# EAGLE design Arduino Board rev3 (EAGLE 8.6.3)
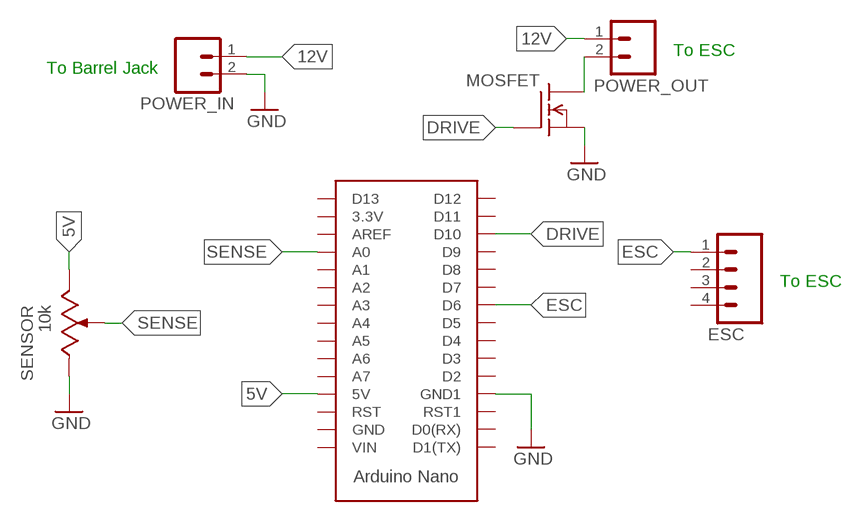
[diagram p0: schematic, sheet 1]

## Parts
ARDUINO_NANO  ARDUINO_NANO  [ARDUINO_NANO]
ESC  M04  [1X04]
MOSFET  N-CHANNEL_MOSFETGENERIC  [TO-220-SINK]
POWER_IN  M02  [1X02]
POWER_OUT  M02  [1X02]
SENSOR  10k  SV03  [SV03A]

## Nets
5V: ARDUINO_NANO.5V SENSOR.3(A)
12V: POWER_IN.1 POWER_OUT.1
DRIVE: ARDUINO_NANO.D10 MOSFET.1(G)
ESC: ARDUINO_NANO.D6 ESC.1
GND: ARDUINO_NANO.GND1 MOSFET.3(S) POWER_IN.2 SENSOR.1(E)
N$3: MOSFET.2(D) POWER_OUT.2
SENSE: ARDUINO_NANO.A0 SENSOR.2(S) SENSOR.2.1(S)
Unconnected: ARDUINO_NANO.3.3V ARDUINO_NANO.A1 ARDUINO_NANO.A2 ARDUINO_NANO.A3 ARDUINO_NANO.A4 ARDUINO_NANO.A5 ARDUINO_NANO.A6 ARDUINO_NANO.A7 ARDUINO_NANO.AREF ARDUINO_NANO.D0(RX) ARDUINO_NANO.D1(TX) ARDUINO_NANO.D2 ARDUINO_NANO.D3 ARDUINO_NANO.D4 ARDUINO_NANO.D5 ARDUINO_NANO.D7 ARDUINO_NANO.D8 ARDUINO_NANO.D9 ARDUINO_NANO.D11 ARDUINO_NANO.D12 ARDUINO_NANO.D13 ARDUINO_NANO.GND ARDUINO_NANO.RST ARDUINO_NANO.RST1 ARDUINO_NANO.VIN ESC.2 ESC.3 ESC.4

## Notes on the sheet
- To ESC
- To Barrel Jack
- To ESC

## Library data of the parts
ARDUINO_NANO = Controls Library:ARDUINO_NANO: Arduino Nano Device Specifications <https://www.arduino.cc/en/Main/ArduinoBoardNano> Pinout Diagram <http://pighixxx.com/nanopdf.pdf>
ESC = Controls Library:M04: Standard 4-pin 0.1" header. NOTES ON THE VARIANTS LOCK and LOCK_LONGPADS... This footprint was designed to help hold the alignment of a through-hole component (i.e. 6-pin header) while soldering it into place. You may notice that each hole has been shifted either up or down by 0.005 of an inch from it's more standard position (which is a perfectly straight line). This slight alteration caused the pins (the squares in the middle) to touch the edges of the holes. Because they are alternating, it causes a "brace" to hold the component in place. 0.005 has proven to be the perfect amount of "off-center" position when using our standard breakaway headers. Although looks a little odd when you look at the bare footprint, once you have a header in there, the alteration is very hard to notice. Also,if you push a header all the way into place, it is covered up entirely on the bottom side. This idea of altering the position of holes to aid alignment will be further integrated into the Sparkfun Library for other footprints. It can help hold any component with 3 or more connection pins. Note: The Sparkfun version includes many other packages including surface mount that may be of future interest. Source: Sparkfun <https://github.com/sparkfun/SparkFun-Eagle-Libraries>
MOSFET = Controls Library:N-CHANNEL_MOSFET: Generic N-Channel MOSFET; _EXTERNAL_: 1
POWER_IN POWER_OUT = Controls Library:M02: Standard 2-pin 0.1" header. NOTES ON THE VARIANTS LOCK and LOCK_LONGPADS... This footprint was designed to help hold the alignment of a through-hole component (i.e. 6-pin header) while soldering it into place. You may notice that each hole has been shifted either up or down by 0.005 of an inch from it's more standard position (which is a perfectly straight line). This slight alteration caused the pins (the squares in the middle) to touch the edges of the holes. Because they are alternating, it causes a "brace" to hold the component in place. 0.005 has proven to be the perfect amount of "off-center" position when using our standard breakaway headers. Although looks a little odd when you look at the bare footprint, once you have a header in there, the alteration is very hard to notice. Also,if you push a header all the way into place, it is covered up entirely on the bottom side. This idea of altering the position of holes to aid alignment will be further integrated into the Sparkfun Library for other footprints. It can help hold any component with 3 or more connection pins. Note: The Sparkfun version includes many other packages including surface mount that may be of future interest. Source: Sparkfun <https://github.com/sparkfun/SparkFun-Eagle-Libraries>
SENSOR = Controls Library:SV03: Murata SV03 Series Rotary Position Sensor Total Resistance: 10 kOhms +/-30% Linearity: +/-2% Effective Rotational Angle: 333.3° Rated Voltage: 5V Datasheet <https://www.murata.com/~/media/webrenewal/support/library/catalog/products/sensor/rotaryposition/r51e.ashx>

## Board
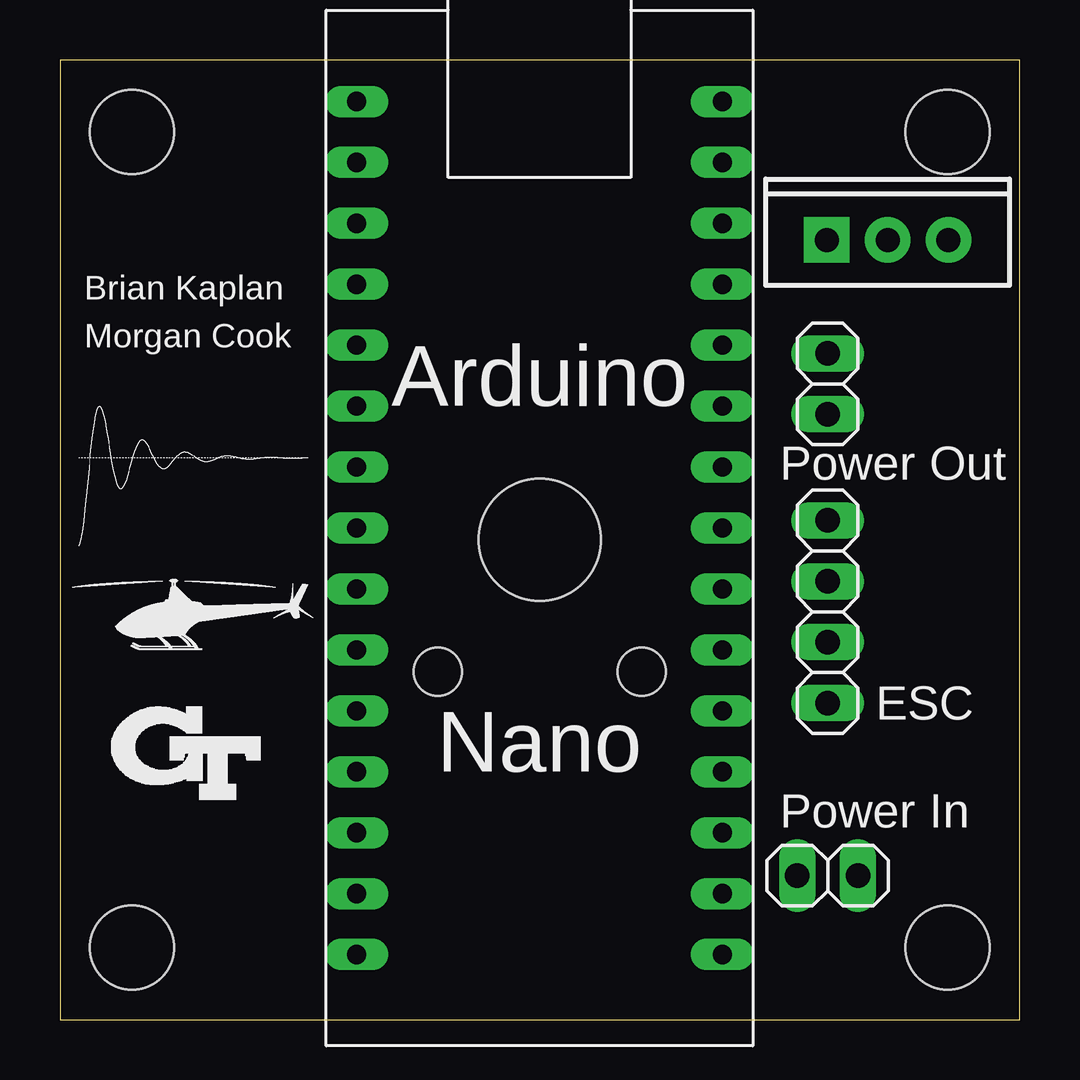
[diagram p1: board, top side]
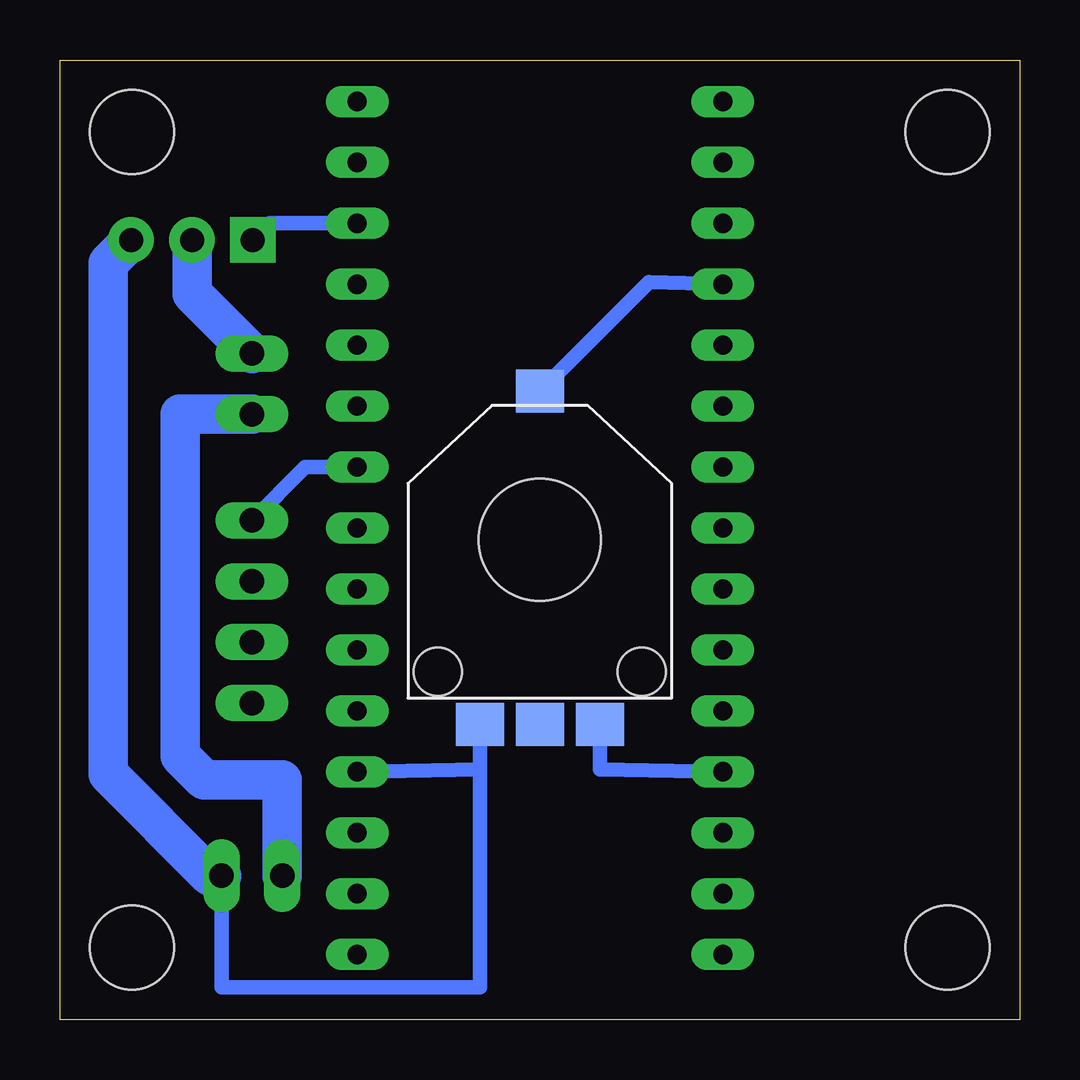
[diagram p2: board, bottom side, seen from below]

Size 40 x 40 mm. Coordinates in mm from the lower left corner, seen from the top.
Outline: 0,0 40,0 40,40 0,40 0,0
Copper layers (1*16): Top 0.035mm / dielectric 1.5mm / Bottom 0.035mm
Design rules "default": minimum track width 6mil, minimum drill 0.35mm, track to track 6mil, track to pad 6mil, pad to pad 6mil, via to via 6mil, smd to smd 6mil, copper to edge 40mil, drill to drill 6mil, minimum pad ring 10mil, minimum via ring 8mil, stop-mask expansion 4mil, vias tented up to drill 0mil, thermal gap 10mil
Holes 3.5 mm at 37,37 37,3 3,3 3,37

### Footprints (pad centres in the part's own frame; a part is rotated, then mirrored left to right if it is on the bottom)
ARDUINO_NANO = drill 0.8 long: 3.3V 1.27,36.83; 5V 1.27,11.43; A0 1.27,31.75; A1 1.27,29.21; A2 1.27,26.67; A3 1.27,24.13; A4 1.27,21.59; A5 1.27,19.05; A6 1.27,16.51; A7 1.27,13.97; AREF 1.27,34.29; D0(RX) 16.51,6.35; D1(TX) 16.51,3.81; D2 16.51,13.97; D3 16.51,16.51; D4 16.51,19.05; D5 16.51,21.59; D6 16.51,24.13; D7 16.51,26.67; D8 16.51,29.21; D9 16.51,31.75; D10 16.51,34.29; D11 16.51,36.83; D12 16.51,39.37; D13 1.27,39.37; GND 1.27,6.35; GND1 16.51,11.43; RST 1.27,8.89; RST1 16.51,8.89; VIN 1.27,3.81
1X04 = drill 1.016 long: 1 -3.81,0; 2 -1.27,0; 3 1.27,0; 4 3.81,0
TO-220-SINK = drill 1 pad 1.88 square: 1 -2.54,0 | drill 1 pad 1.88: 2 0,0; 3 2.54,0
1X02 = drill 1.016 long: 1 -1.27,0; 2 1.27,0
SV03A = smd 2 x 1.8: 1 -2.5,-7.7; 2 0,-7.7; 2.1 0,6.2; 3 2.5,-7.7 | hole 5.1: 0,0 | hole 2: -4.25,-5.5; 4.25,-5.5

### Placement (x,y rotation side)
ARDUINO_NANO  11.1,-1.1 0 top
ESC  32,17 270 top
MOSFET  34.5,32.5 0 top
POWER_IN  32,6 0 top
POWER_OUT  32,26.5 90 top
SENSOR  20,20 0 bottom

### Tracks (layer width: path | path; a pad name or v marks a point on that pad's centre or on a via)
5V
  Bottom 0.61: ARDUINO_NANO.5V 17.5,10.43 SENSOR.3
12V
  Bottom 1.651: POWER_OUT.1 35,25.23 35,11 34,10 33,10 30.73,10 POWER_IN.1
DRIVE
  Bottom 0.61: ARDUINO_NANO.D10 31.27,33.19 MOSFET.1
ESC
  Bottom 0.61: ESC.1 29.78,23.03 ARDUINO_NANO.D6
GND
  Bottom 0.61: ARDUINO_NANO.GND1 22.5,10.43 | 22.5,10.43 SENSOR.1 | 22.5,10.43 22.5,1.35 33.27,1.35 POWER_IN.2
  Bottom 1.651: MOSFET.3 38,31.54 38,10.23 33.77,6 POWER_IN.2
N$3
  Bottom 1.651: POWER_OUT.2 34.5,30.27 MOSFET.2
SENSE
  Bottom 0.61: ARDUINO_NANO.A0 15.45,30.75 SENSOR.2.1

### Text on the board
tPlace: Brian Kaplan | Morgan Cook
tNames: Power Out | ESC | Power In